# Altium project wearable_electrode_array.PrjPcb
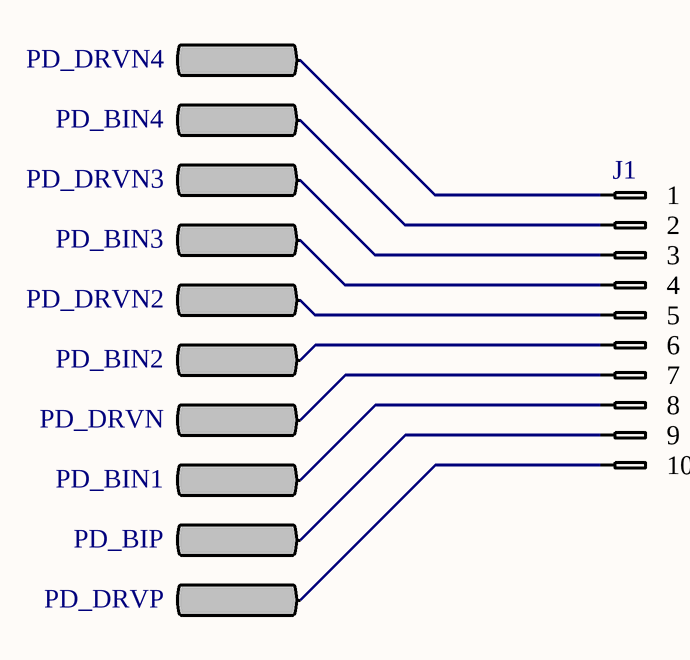
[diagram p0: elec_array.SchDoc]
CAGE_CODE: ?????; CONTRACT_NUMBER: <CONTRACT NO>; DOC_NO_ASSY_DWG: <ASSY DWG NO>; DOC_NO_BOM: <BOM DOC NO>; DOC_NO_FAB_DWG: <FAB DWG NO>; DOC_NO_SCH_DWG: <SCH DWG NO>; PCB_2_DEC_TOL: +/-.01; PCB_3_DEC_TOL: +/-.010; PCB_ANG_TOL: +/-1/2; PCB_ASSEMBLY_NO: <PCB ASSY NO>; PCB_CHECKER: - -----; PCB_CHECKER_APP_DATE: --/--/----; PCB_DESIGNER: - -----; PCB_DESIGNER_APP_DATE: --/--/----; PCB_DWG_NO: <PCB DWG NO>; PCB_ENGINEER: - -----; PCB_ENGINEER_APP_DATE: --/--/----; PCB_PART_NUMBER: <PCB PN>; PCB_REV: A; SCH_REV: A
1 sheet, 11 parts. Net scope: global (net labels, ports and power ports of the same name join across sheets).
Board file: elec_array.PcbDoc

## Sheet elec_array.SchDoc
size 99 x 127 mm; SheetNumber: 1; SheetTotal: 1

### Parts
J1  Array_Conn_Mate_Pad  [ARRAY_CONN_MATE_PAD]  (value not drawn)
PD_BIN1  Skin_Interface_Pad  [Skin_Interface_Pad]  (value not drawn)
PD_BIN2  Skin_Interface_Pad  [Skin_Interface_Pad]  (value not drawn)
PD_BIN3  Skin_Interface_Pad  [Skin_Interface_Pad]  (value not drawn)
PD_BIN4  Skin_Interface_Pad  [Skin_Interface_Pad]  (value not drawn)
PD_BIP  Skin_Interface_Pad  [Skin_Interface_Pad]  (value not drawn)
PD_DRVN  Skin_Interface_Pad  [Skin_Interface_Pad]  (value not drawn)
PD_DRVN2  Skin_Interface_Pad  [Skin_Interface_Pad]  (value not drawn)
PD_DRVN3  Skin_Interface_Pad  [Skin_Interface_Pad]  (value not drawn)
PD_DRVN4  Skin_Interface_Pad  [Skin_Interface_Pad]  (value not drawn)
PD_DRVP  Skin_Interface_Pad  [Skin_Interface_Pad]  (value not drawn)

### Nets
NetJ1_1: J1.1 PD_DRVN4.1
NetJ1_2: J1.2 PD_BIN4.1
NetJ1_3: J1.3 PD_DRVN3.1
NetJ1_4: J1.4 PD_BIN3.1
NetJ1_5: J1.5 PD_DRVN2.1
NetJ1_6: J1.6 PD_BIN2.1
NetJ1_7: J1.7 PD_DRVN.1
NetJ1_8: J1.8 PD_BIN1.1
NetJ1_9: J1.9 PD_BIP.1
NetJ1_10: J1.10 PD_DRVP.1

### Library data of the parts
J1 = Array_Conn_Mate_Pad: System: Connector